# Altium schematic sheet capstone_v1.1.SchDoc
size B; SheetNumber: 1; SheetTotal: 1
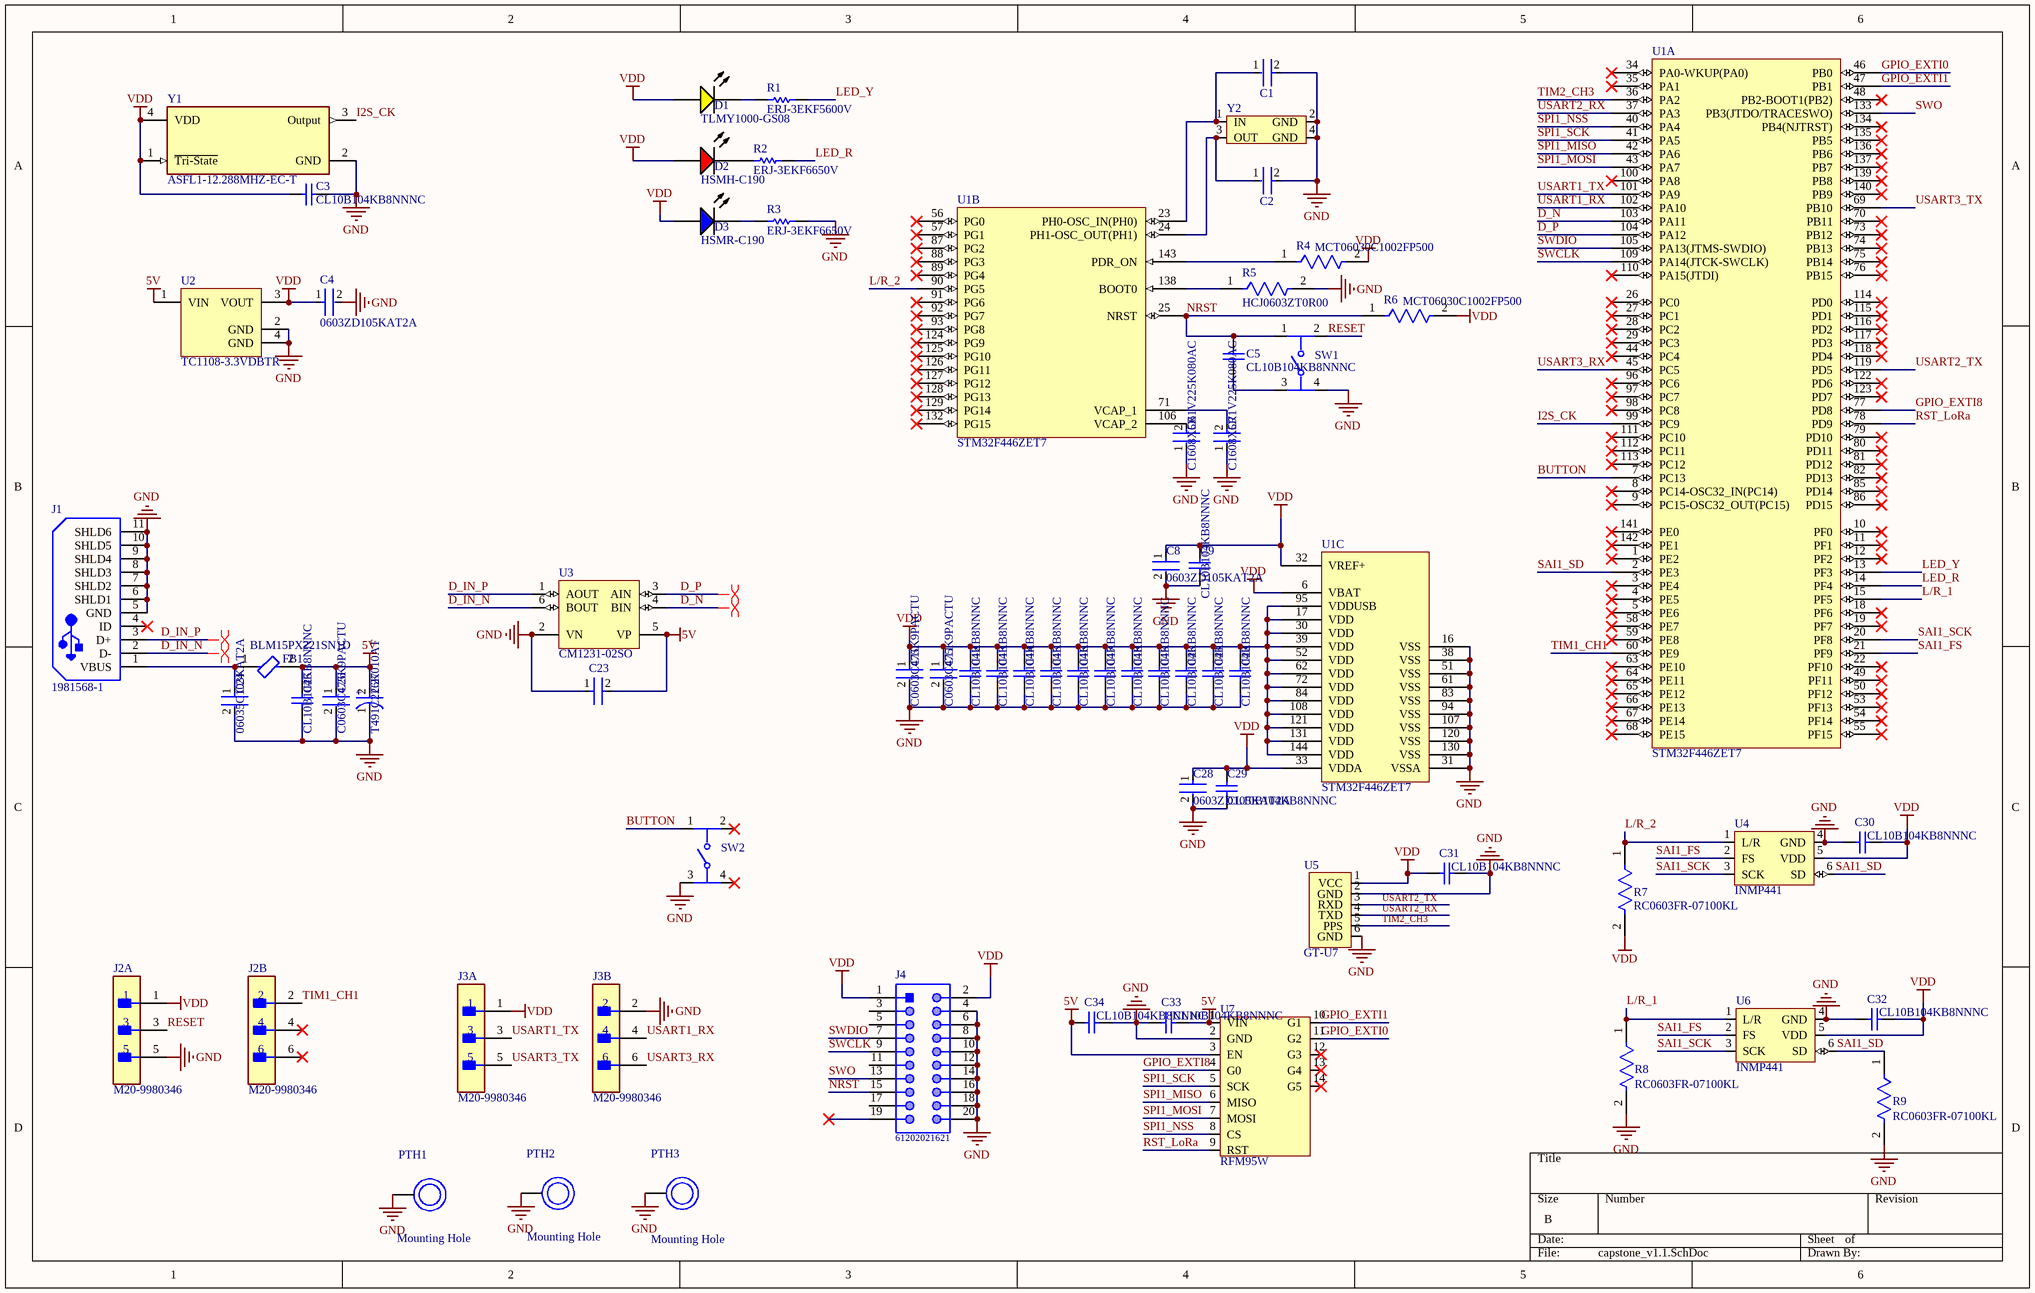
[diagram p0: capstone_v1.1.SchDoc]

## Parts
C1  C1608C0G1H150J080AA  [FP-C1608-080-0_1-MFG]  (value not drawn)
C2  C1608C0G1H150J080AA  [FP-C1608-080-0_1-MFG]  (value not drawn)
C3  CL10B104KB8NNNC  [SAMS-C0603-2_M]
C4  0603ZD105KAT2A  [FP-0603-L_1_6_0_15-W_0_81-IPC_A]
C5  CL10B104KB8NNNC  [SAMS-C0603-2_M]
C6  C1608X5R1V225K080AC  [FP-C1608-080-0_1-MFG]
C7  C1608X5R1V225K080AC  [FP-C1608-080-0_1-MFG]
C8  0603ZD105KAT2A  [FP-0603-L_1_6_0_15-W_0_81-IPC_A]
C9  CL10B104KB8NNNC  [SAMS-C0603-2_M]
C10  C0603C475K9PACTU  [FP-C0603-CG-MFG]
C11  C0603C475K9PACTU  [FP-C0603-CG-MFG]
C12  CL10B104KB8NNNC  [SAMS-C0603-2_M]
C13  CL10B104KB8NNNC  [SAMS-C0603-2_M]
C14  CL10B104KB8NNNC  [SAMS-C0603-2_M]
C15  CL10B104KB8NNNC  [SAMS-C0603-2_M]
C16  CL10B104KB8NNNC  [SAMS-C0603-2_M]
C17  CL10B104KB8NNNC  [SAMS-C0603-2_M]
C18  CL10B104KB8NNNC  [SAMS-C0603-2_M]
C19  CL10B104KB8NNNC  [SAMS-C0603-2_M]
C20  CL10B104KB8NNNC  [SAMS-C0603-2_M]
C21  CL10B104KB8NNNC  [SAMS-C0603-2_M]
C22  CL10B104KB8NNNC  [SAMS-C0603-2_M]
C23  GRM188R71E224KA88D  [FP-GRM188-0_1-e0_2_0_5-IPC_C]  (value not drawn)
C24  06035C103KAT2A  [FP-0603-L_1_6_0_15-W_0_81-MFG]
C25  CL10B104KB8NNNC  [SAMS-C0603-2_M]
C26  C0603C475K9PACTU  [FP-C0603-CG-MFG]
C27  T491C226K010AT  [FP-T491C226K010AT-MFG]
C28  0603ZD105KAT2A  [FP-0603-L_1_6_0_15-W_0_81-IPC_A]
C29  CL10B104KB8NNNC  [SAMS-C0603-2_M]
C30  CL10B104KB8NNNC  [SAMS-C0603-2_M]
C31  CL10B104KB8NNNC  [SAMS-C0603-2_M]
C32  CL10B104KB8NNNC  [SAMS-C0603-2_M]
C33  CL10B104KB8NNNC  [SAMS-C0603-2_M]
C34  CL10B104KB8NNNC  [SAMS-C0603-2_M]
D1  TLMY1000-GS08  [VISH-TLMY1000_V]
D2  HSMH-C190  [AVAG-HSMX-C190_V]
D3  HSMR-C190  [AVAG-HSMX-C190_V]
FB1  BLM15PX221SN1D  [FP-BLM15-0_05-IPC_A]
J1  1981568-1  [TECO-1981568-5_V]
J2  M20-9980346  [FP-M20-9980346-MFG]  (parts A,B of 2)
J3  M20-9980346  [FP-M20-9980346-MFG]  (parts A,B of 2)
J4  61202021621  [61202021621]
PTH1  Mounting Hole  [MB Stand off]
PTH2  Mounting Hole  [MB Stand off]
PTH3  Mounting Hole  [MB Stand off]
R1  ERJ-3EKF5600V  [RESC1608X55X30ML15T15]
R2  ERJ-3EKF6650V  [RESC1608X55X30ML15T15]
R3  ERJ-3EKF6650V  [RESC1608X55X30ML15T15]
R4  MCT06030C1002FP500  [FP-MCT0603-IPC_C]
R5  HCJ0603ZT0R00  [FP-HCJ0603-MFG]
R6  MCT06030C1002FP500  [FP-MCT0603-IPC_C]
R7  RC0603FR-07100KL  [FP-RC0603-0_55-MFG]
R8  RC0603FR-07100KL  [FP-RC0603-0_55-MFG]
R9  RC0603FR-07100KL  [FP-RC0603-0_55-MFG]
SW1  PTS645SM43SMTR92LFS  [FP-PTS645SM43SMTR92LFS-MFG]  (value not drawn)
SW2  PTS645SM43SMTR92LFS  [FP-PTS645SM43SMTR92LFS-MFG]  (value not drawn)
U1  STM32F446ZET7  [STM-LQFP144_M]  (parts A,B,C of 3)
U2  TC1108-3.3VDBTR  [SOT-223-DB3_L]
U3  CM1231-02SO  [ONSC-SOT23-6-527AJ_V]
U4  INMP441  [INMP441]
U5  GT-U7  [GT U7 GPS]
U6  INMP441  [INMP441]
U7  RFM95W  [RFM95W]
Y1  ASFL1-12.288MHZ-EC-T  [FP-ASFL1-MFG]
Y2  2151-RH100-8.000-10-1010-EXT-TRCT-ND  [2151-RH100-8.000-10-1010-EXT-TRCT-ND]  (value not drawn)

## Nets
5V: C23.2 C25.2 C26.1 C27.2(A) C33.1 C34.2 FB1.2 U2.1(VIN) U3.5(VP) U7.1(VIN) U7.3(EN)
GND: C1.2 C2.2 C3.1 C4.2 C6.1 C7.1 C8.2 C9.1 C10.2 C11.2 C12.1 C13.1 C14.1 C15.1 C16.1 C17.1 C18.1 C19.1 C20.1 C21.1 C22.1 C23.1 C24.2 C25.1 C26.2 C27.1(C) C28.2 C29.1 C30.2 C31.1 C32.2 C33.2 C34.1 J1.5(GND) J1.6(SHLD1) J1.7(SHLD2) J1.8(SHLD3) J1.9(SHLD4) J1.10(SHLD5) J1.11(SHLD6) J2.5 J3.2 J4.4 J4.6 J4.8 J4.10 J4.12 J4.14 J4.16 J4.18 J4.20 PTH1.1 PTH2.1 PTH3.1 R3.2 R5.2 R8.2 R9.2 SW1.4 SW2.3 U1.16(VSS) U1.31(VSSA) U1.38(VSS) U1.51(VSS) U1.61(VSS) U1.83(VSS) U1.94(VSS) U1.107(VSS) U1.120(VSS) U1.130(VSS) U2.2(GND) U2.4(GND) U3.2(VN) U4.4(GND) U5.2(GND) U5.6(GND) U6.4(GND) U7.2(GND) Y1.2(GND) Y2.2(GND) Y2.4(GND)
VDD: C3.2 C4.1 C8.1 C9.2 C10.1 C11.1 C12.2 C13.2 C14.2 C15.2 C16.2 C17.2 C18.2 C19.2 C20.2 C21.2 C22.2 C28.1 C29.2 C30.1 C31.2 C32.1 D1.1(A) D2.1(A) D3.1(A) J2.1 J3.1 J4.1 J4.2 R4.2 R6.2 R7.2 U1.6(VBAT) U1.17(VDD) U1.30(VDD) U1.32(VREF+) U1.33(VDDA) U1.39(VDD) U1.52(VDD) U1.62(VDD) U1.72(VDD) U1.84(VDD) U1.95(VDDUSB) U1.108(VDD) U1.121(VDD) U1.131(VDD) U1.144(VDD) U2.3(VOUT) U4.5(VDD) U5.1(VCC) U6.5(VDD) Y1.1(~{Tri-State}) Y1.4(VDD)
BUTTON: SW2.1 U1.7(PC13)
D_IN_N: J1.2(D-) U3.6(BOUT)
D_IN_P: J1.3(D+) U3.1(AOUT)
D_N: U1.103(PA11) U3.4(BIN)
D_P: U1.104(PA12) U3.3(AIN)
GPIO_EXTI0: U1.46(PB0) U7.11(G2)
GPIO_EXTI1: U1.47(PB1) U7.10(G1)
GPIO_EXTI8: U1.77(PD8) U7.4(G0)
I2S_CK: U1.99(PC9) Y1.3(Output)
L/R_1: R8.1 U1.15(PF5) U6.1(L/R)
L/R_2: R7.1 U1.90(PG5) U4.1(L/R)
LED_R: R2.2 U1.14(PF4)
LED_Y: R1.2 U1.13(PF3)
NRST: C5.2 J4.15 R6.1 SW1.1 U1.25(NRST)
RESET: J2.3 SW1.2
RST_LoRa: U1.78(PD9) U7.9(RST)
SAI1_FS: U1.21(PF9) U4.2(FS) U6.2(FS)
SAI1_SCK: U1.20(PF8) U4.3(SCK) U6.3(SCK)
SAI1_SD: R9.1 U1.2(PE3) U4.6(SD) U6.6(SD)
SPI1_MISO: U1.42(PA6) U7.6(MISO)
SPI1_MOSI: U1.43(PA7) U7.7(MOSI)
SPI1_NSS: U1.40(PA4) U7.8(CS)
SPI1_SCK: U1.41(PA5) U7.5(SCK)
SWCLK: J4.9 U1.109(PA14(JTCK-SWCLK))
SWDIO: J4.7 U1.105(PA13(JTMS-SWDIO))
SWO: J4.13 U1.133(PB3(JTDO/TRACESWO))
TIM1_CH1: J2.2 U1.60(PE9)
TIM2_CH3: U1.36(PA2) U5.5(PPS)
USART1_RX: J3.4 U1.102(PA10)
USART1_TX: J3.3 U1.101(PA9)
USART2_RX: U1.37(PA3) U5.4(TXD)
USART2_TX: U1.119(PD5) U5.3(RXD)
USART3_RX: J3.6 U1.45(PC5)
USART3_TX: J3.5 U1.69(PB10)
NetC1_1: C1.1 U1.23(PH0-OSC_IN(PH0)) Y2.1(IN)
NetC2_1: C2.1 U1.24(PH1-OSC_OUT(PH1)) Y2.3(OUT)
NetC5_1: C5.1 SW1.3
NetC6_2: C6.2 U1.106(VCAP_2)
NetC7_2: C7.2 U1.71(VCAP_1)
NetC24_1: C24.1 FB1.1 J1.1(VBUS)
NetD1_2: D1.2(K) R1.1
NetD2_2: D2.2(K) R2.1
NetD3_2: D3.2(K) R3.1
NetR4_1: R4.1 U1.143(PDR_ON)
NetR5_1: R5.1 U1.138(BOOT0)

Not connected (* = marked no-connect by the designer): J1 4(ID)*; J2 4* 6*; J4 3 5 11 17 19*; SW2 2* 4*; U1 1(PE2)* 3(PE4)* 4(PE5)* 5(PE6)* 8(PC14-OSC32_IN(PC14))* 9(PC15-OSC32_OUT(PC15))* 10(PF0)* 11(PF1)* 12(PF2)* 18(PF6)* 19(PF7)* 22(PF10)* 26(PC0)* 27(PC1)* 28(PC2)* 29(PC3)* 34(PA0-WKUP(PA0))* 35(PA1)* 44(PC4)* 48(PB2-BOOT1(PB2))* 49(PF11)* 50(PF12)* 53(PF13)* 54(PF14)* 55(PF15)* 56(PG0)* 57(PG1)* 58(PE7)* 59(PE8)* 63(PE10)* 64(PE11)* 65(PE12)* 66(PE13)* 67(PE14)* 68(PE15)* 70(PB11)* 73(PB12)* 74(PB13)* 75(PB14)* 76(PB15)* 79(PD10)* 80(PD11)* 81(PD12)* 82(PD13)* 85(PD14)* 86(PD15)* 87(PG2)* 88(PG3)* 89(PG4)* 91(PG6)* 92(PG7)* 93(PG8)* 96(PC6)* 97(PC7)* 98(PC8)* 100(PA8)* 110(PA15(JTDI))* 111(PC10)* 112(PC11)* 113(PC12)* 114(PD0)* 115(PD1)* 116(PD2)* 117(PD3)* 118(PD4)* 122(PD6)* 123(PD7)* 124(PG9)* 125(PG10)* 126(PG11)* 127(PG12)* 128(PG13)* 129(PG14)* 132(PG15)* 134(PB4(NJTRST))* 135(PB5)* 136(PB6)* 137(PB7)* 139(PB8)* 140(PB9)* 141(PE0)* 142(PE1)*; U7 12(G3)* 13(G4)* 14(G5)*

## Layout directives
differential pair: D_IN_N, D_IN_P, D_N, D_P

## Notes on the sheet
- (in symbol CMP-03017-000041-1) +

## Library data of the parts
C1 C2 = CMP-08246-005526-1: Multilayer Ceramic Capacitors 15pF ±5% 50V C0G SMD 0603; Temperature Coefficient: 30ppm/°C; Thickness: 0.037inch; Number of Pins: 2; Height: 0.8mm; Depth: 0.8mm; Capacitance: 15pF; Voltage: 50V; Construction: Flat; Series: C; Radiation Hardening: No; Width: 0.031inch; Packaging: Tape and Reel; Voltage Rating (DC): 50V; Termination: SMD/SMT; RoHS Compliant: Yes; Voltage Rating: 50V; Case Code (Imperial): 0603; Package Quantity: 1; Min Operating Temperature: -55°C; Lead Free: Lead Free; Case Code (Metric): 1608; Max Operating Temperature: 125°C; Tolerance: 5%; REACH SVHC: No SVHC; Dielectric: C0G; Length: 1.6mm; Mount: Surface Mount; Weight: 7.1E-05oz; Dielectric Material: Ceramic; Case/Package: 0603
C3 C5 C9 C12-C22 C25 C29-C34 = CMP-2000-05332-1: Multi-layer Ceramic Capacitor, -55 to 125 degC, 2-Pin SMD (0603), RoHS, Tape and Reel; Manufacturer: Samsung Electro-Mechanics; Capacitance: 0.1µF; Rated Voltage: 50V; Dielectric: X7R; Tolerance (%): ±10%; Case Size/Dimension: 0603; Datasheet URL: https://datasheet.ciiva.com/29198/456651-da-01-en-vs-kondensator-0605-29198839.pdf; Manufacturer URL: http://www.samsungsem.com/global/index.jsp; Datasheet Version: Nov-10
C4 C8 C28 = CMP-2006-04559-3: General Purpose Ceramic Capacitor, 0603, 1uF, 10%, X5R, 15%, 10V; Insulation Resistance: 100GR; Dissipation Factor: 5%; Packaging: Tape and Reel; RoHS Compliant: Yes; Height: 0.9mm; Tolerance: 10%; Length: 1.6mm; Depth: 0.81mm; Case/Package: 0603; Max Operating Temperature: 85°C; Series: -; Dielectric: X5R; Construction: Flat; Capacitance: 1uF; REACH SVHC: No SVHC; Voltage Rating: 10V; Number of Pins: 2; Radiation Hardening: No; Case Code (Imperial): 0603; Min Operating Temperature: -55°C; Termination: SMD/SMT; Contact Plating: Tin; Voltage: 10V; Thickness: 0.035inch; Lead Free: Lead Free; Mount: Surface Mount; Width: 0.81mm; Voltage Rating (DC): 10V; Package Quantity: 4000; Case Code (Metric): 1608
C6 C7 = CMP-08246-004960-1: Multilayer Ceramic Capacitors 2.2μF ±10% 35V X5R SMD 0603; Capacitance: 2.2uF; Dielectric Material: Ceramic; Length: 1.6mm; Height: 0.8mm; Package Quantity: 1; Width: 0.031inch; Radiation Hardening: No; Lead Free: Lead Free; Mount: Surface Mount; REACH SVHC: No SVHC; Construction: Flat; Voltage Rating (DC): 35V; Voltage Rating: 35V; Case/Package: 0603; Termination: SMD/SMT; Dielectric: X5R; Resistor Type: Ceramic; Thickness: 800um; Tolerance: 10%; Case Code (Metric): 1608; Case Code (Imperial): 0603; Weight: 7.1E-05oz; RoHS Compliant: Yes; Min Operating Temperature: -55°C; Series: C; Max Operating Temperature: 85°C; Depth: 0.8mm; Voltage: 35V; Packaging: Tape and Reel
C10 C11 C26 = CMP-2006-02256-2: CAP CER 4.7UF 6.3V X5R 0603; Manufacturer: Kemet; Temperature Coefficient: 15%; Tolerance: 10%; Material: Ceramic; Device Class L3: Ceramic Capacitors; RoHS: TRUE; Value: 4.7uF; Lead Free: Yes; ComponentLink2Description: Datasheet; Mouser Description: Multilayer Ceramic Capacitors MLCC - SMD/SMT 6.3volts 4.7uF X5R 10%; Package: C0603-CG; Digikey Description: CAP CER 4.7UF 6.3V X5R 0603; ComponentLink2URL: https://content.kemet.com/datasheets/KEM_C1006_X5R_SMD.pdf; Category: Cap; Temperature Range Low: -55°C; Capacitance: 4.7uF; Temperature: -55°C to +85°C; Octopart: https://octopart.com/c0603c475k9pactu-kemet-104242; Ipc Land Pattern Name: CAPC16080X80; Voltage Rating: 6.3V; Temperature Range High: +85°C; Height: 0.9mm; Temperature Characteristic: X5R; Device Class L1: Passive Components; Manufacturer Part Number: C0603C475K9PACTU; Automotive: No; Device Class L2: Capacitors
C23 = CMP-1035-02648-3: Chip Multilayer Ceramic Capacitors for General Purpose, 0603, 0.22uF, X7R, 15%, 10%, 25V; Voltage: 50V; Capacitance: 220nF; Number of Pins: 2; Length: 1.6mm; Material: Ceramic; Depth: 0.8mm; REACH SVHC: No SVHC; Voltage Rating (DC): 25V; Tolerance: 10%; Max Operating Temperature: 125°C; Lead Free: Lead Free; Package Quantity: 1; Voltage Rating: 25V; Width: 0.8mm; Case Code (Metric): 1608; Min Operating Temperature: -55°C; Case/Package: 0603; Mount: Surface Mount; Dielectric: X7R; Height: 0.8mm; Termination: SMD/SMT; Radiation Hardening: No; Case Code (Imperial): 0603; Thickness: 0.035inch; Packaging: Tape and Reel
C24 = CMP-2006-04374-2: General Purpose Ceramic Capacitor, 0603, 10nF, 10%, X7R, 15%, 50V; Insulation Resistance: 100GR; Dissipation Factor: 2.5%; Voltage: 50V; Number of Pins: 2; Min Operating Temperature: -55°C; Mount: Surface Mount; Capacitance: 10nF; Width: 0.032inch; Height: 0.9mm; Voltage Rating: 50V; Termination: SMD/SMT; Package Quantity: 1; Dielectric: X7R; Max Operating Temperature: 125°C; Contact Plating: Tin; Length: 1.6mm; Dielectric Material: Ceramic; REACH SVHC: No SVHC; Case Code (Imperial): 0603; Depth: 0.81mm; Thickness: 0.035inch; Packaging: Tape and Reel; Tolerance: 10%; Lead Free: Lead Free; Voltage Rating (DC): 50V; Radiation Hardening: No; Case/Package: 0603; Case Code (Metric): 1608
C27 = CMP-03017-000041-1: CAP TANT 22UF 10% 10V 2312; Polarity: Polar; Leakage Current: 2.2uA; Tolerance: 20%; Life (Hours): 2000Hour; Dissipation Factor: 6%; ESR (Equivalent Series Resistance): 1.8R; Dielectric Material: Tantalum; Packaging: Tape and Reel; Termination: SMD/SMT; Length: 6mm; Voltage Rating (DC): 10V; Series: T491; Case/Package: Molded; Lead Free: Lead Free; Mount: Surface Mount; RoHS Compliant: Yes; Number of Pins: 2; Voltage Rating: 10V; Case Code (Imperial): 2312; Width: 3.2mm; Case Code (Metric): 6032; Voltage: 10V; Depth: 3.2mm; Features: General Purpose; Height - Seated (Max): 0.11inch; Capacitance: 22uF; Size: 2.5mm; Max Operating Temperature: 125°C; Construction: Flat; REACH SVHC: No SVHC; Package Quantity: 1; Min Operating Temperature: -55°C; Radiation Hardening: No; Height: 2.5mm
D1 = CMP-2000-07255-1: Low Current LED, 40 mW, -40 to 100 degC, 2-Pin SMD, RoHS, Tape and Reel; Manufacturer: Vishay; Wavelength Typ: 595nm; Forward Current If: 2mA; Viewing Angle: 80°; Bulb Size: 1.6mmx0.8mm; Forward Voltage: 1.8V; Luminous Intensity: 7.5mcd; SVHC: ToBeAdvised; Automotive Qualification Standard: AEC-Q100; LED Colour: Yellow; Lens Shape: Rectangular; LED Mounting: SMD; Mounting Technology: SurfaceMount; Packaging: CutTape; MSL: MSL2-1year; Datasheet URL: http://www.vishay.com/docs/83172/tlmo1000.pdf; Package Reference: TLMY1000; Manufacturer URL: http://www.vishay.com/; Package Description: 2-Pin Surface Mount Device, Body 1.6 x 0.8 mm; Datasheet Version: Rev. 2.0, 09/2013; Product Range: -
D2 = CMP-1744-00004-1: LED Uni-Color Red, 65 mW, 20 mA, -40 to 85 degC, 2-Pin SMD, RoHS, Tape and Reel; Connector Type: USB; Gender: Male; Current Rating: 1 A; Length: 7.5 mm; Lead Pitch: 0.65 mm; PackageReference: HSMX-C190; Package Quantity: 2000; Max Operating Temperature: 85 degC; PackageDescription: 2-Pin Surface Mount Device, Body 1.6 x 0.8 mm, Height 0.9 mm; ComponentLink3Description: Package Specification; Mount: Surface Mount; Min Operating Temperature: -30 degC; ComponentLink3URL: http://www.fairchildsemi.com/dwg/MA/MA03D.pdf; ComponentLink1Description: Manufacturer URL; Contact Material: Copper; Pins: 5; Width: 5.6 mm; ComponentLink2Description: Datasheet; RoHSCompliant: true; DatasheetVersion: Mar-12; Height: 2.8 mm; Packaging: Tape and Reel; Contact Plating: Gold; ComponentLink1URL: http://www.avagotech.com/; REACH SVHC: No SVHC; ComponentLink2URL: http://docs.avagotech.com/docs/AV02-0551EN
D3 = CMP-1744-00007-1: LED Uni-Color Blue, 78 mW, 20 mA, -40 to 85 degC, 2-Pin SMD, RoHS, Tape and Reel; Rds On Max: 10 Ohm; Nominal Vgs: -1.7 V; Max Power Dissipation: 360 mW; Elements: 1; Case\Package: TO-236-3; Input Capacitance: 73 pF; Typical Rise Time: 6.3 ns; Nominal Dual Supply Voltage: -50 V; Packaging: Tape and Reel; Height: 0.93 mm; Mount: Surface Mount; RoHSCompliant: true; DatasheetVersion: Apr-10; REACH SVHC: No SVHC; ComponentLink1URL: http://www.avagotech.com/; Radiation Hardening: No; ComponentLink3Description: Package Specification; ComponentLink3URL: http://www.fairchildsemi.com/dwg/MA/MA03D.pdf; ComponentLink2Description: Datasheet; PackageDescription: 2-Pin Surface Mount Device, Body 1.6 x 0.8 mm, Height 0.9 mm; Package Quantity: 3000; PackageReference: HSMX-C190; ComponentLink1Description: Manufacturer URL; Pins: 3; Length: 2.92 mm; ComponentLink2URL: http://docs.avagotech.com/docs/AV02-0977EN; Min Operating Temperature: -55 degC; Width: 1.3 mm; Max Operating Temperature: 150 degC
FB1 = CMP-0686-00269-4: Chip Ferrite Bead, 0402, 220Ω @ 100MHz, 0.1Ω, 25%, 1.4A; DC Resistance (DCR): 100mR; Material: Steel; Number of Circuits: 1; Impedance: 220R; Lead Free: Lead Free; Packaging: Tape and Reel; Test Frequency: 100MHz; Current Rating: 1.4A; Length: 1mm; Package Quantity: 1; Termination: SMD/SMT; RoHS Compliant: Yes; Max Current Rating: 1.4A; Case/Package: 0402; Number of Pins: 2; Max Operating Temperature: 125°C; Series: BLM15PX; Width: 0.5mm; Case Code (Metric): 1005; Height: 0.5mm; Case Code (Imperial): 0402; Max DC Current: 1.4A; Tolerance: 25%; Number of Lines: 1; Min Operating Temperature: -55°C
J1 = CMP-2000-05408-1: Micro USB Receptacle Standard Type B Assy, 5-Pin SMD, RoHS, Tape and Reel; Manufacturer: TE Connectivity; Body Orientation: RightAngle; Number of Ports: 1Port; Number of Contacts: 5POS; Gender: RCP; Voltage Rating Max: 30VAC; Product Depth (mm): 5.6mm; Pitch (mm): 0.65mm; Current Rating (Max): 1/ContactA; Product Length (mm): 8mm; Product Height (mm): 3mm; Operating Temperature Max Deg. C: 85C; Datasheet URL: http://www.mouser.com/ds/2/418/NG_CD_1981568_E2-621296.pdf; Termination Method: Solder; Number of Terminals: 5; Operating Temp Range: -55Cto85C; Mounting Style: SurfaceMount; Manufacturer URL: http://www.te.com/; Contact Material: CopperAlloy; Packaging: TapeandReel; Datasheet Version: Rev. E2, 08/2015; Operating Temperature Min Deg. C: -55C; Housing Material: Thermoplastic; Type: MicroUSB; Contact Plating: GoldOverNickel
J2 J3 = CMP-2000-06636-2: CONN HEADER VERT 6POS 2.54MM; Manufacturer: Harwin; Current Rating: 3A; Number Of Contacts: 6; Conn Gender: Male; Conn Orientation: Vertical; Device Class L1: Connectors; ComponentLink2Description: Datasheet; Height: 8.99mm; Temperature Range High: +105°C; Contact Material: Tin,Nickel; RoHS: TRUE; Temperature Range Low: -40°C; ComponentLink2URL: https://cdn.harwin.com/pdfs/M20-998.pdf; Digikey Description: CONN HEADER VERT 6POS 2.54MM; Pitch: 2.54mm; Package: M20-9980346; Device Class L2: Headers and Wire Housings; Manufacturer Part Number: M20-9980346; Number Of Rows: 2; Category: Conn; Lead Free: Yes; Mouser Description: 2.54mm (0.1") Pitch DIL Vertical PC Tail Pin Header, 6.1mm mating pin height, tin, 3+3 contacts; Temperature: -40°C to +105°C; Device Class L3: unset; Octopart: https://octopart.com/m20-9980346-harwin-5436545; Automotive: No
J4 = CMP-1502-00010-1: Male Box Header WR-BHD, THT, Vertical, pitch 2.54 mm, 20 pins; Manufacturer: Wurth Elektronik; Contact Resistance: 20mOhm; Withstanding Voltage: 500VAC; Pitch: 2.54mm; Pin Number: 20; Working Voltage: 250VAC; Orientation: Vertical; Package Reference: 61202021621; Publisher: WurthElektronik; Datasheet URL: https://katalog.we-online.de/em/datasheet/6120xx21621.pdf; Operating Temperature: -40to125degC; Packaging: Tray; Part Number: 61202021621; Mounting Technology: THT; Gender: Male; Manufacturer URL: http://www.we-online.de; Published Date: August2018
PTH1-PTH3 = Mounting Hole: MB Standoffs
R1 = CMP-2000-00564-2: Chip Resistor, 560 Ohm, +/- 1%, 0.1 W, -55 to 155 degC, 0603 (1608 Metric), RoHS, Tape and Reel; Output Current: 2 A; Max Supply Voltage: 5 V; Min Supply Voltage: 3 V; Output Voltage: 35 V; Case\Package: QFN; Outputs: 1; PackageDescription: 2-Pin Surface Mount Device, Body 1.6 x 0.85 mm; ComponentLink1Description: Manufacturer URL; ComponentLink1URL: http://www.panasonic.com/; ComponentLink2Description: Datasheet; Package Quantity: 1500; DatasheetVersion: Apr-15; Min Operating Temperature: -20 degC; PackageReference: 0603; RoHSCompliant: true; Packaging: Tape and Reel; ComponentLink2URL: http://industrial.panasonic.com/cdbs/www-data/pdf/RDA0000/AOA0000C86.pdf; Radiation Hardening: No; REACH SVHC: No SVHC; Mount: Surface Mount; Max Operating Temperature: 85 degC; Pins: 28
R2 R3 = CMP-2000-00608-1: Manufacturer: Panasonic; Part Number: ERJ-3EKF6650V
R4 R6 = CMP-02407-000418-1: RES SMD 100 OHM 1% 1/8W 0603; Voltage Rating: 75V; Power Rating: 100mW; Temperature Coefficient: 50ppm/°C; Max Power Dissipation: 125mW; Resistance: 10kR; Case/Package: 0603; Military Standard: Not; Min Operating Temperature: -55°C; Width: 0.8mm; Package Quantity: 1; Max Operating Temperature: 125°C; Tolerance: 1%; Depth: 0.85mm; Radiation Hardening: No; Mount: Surface Mount; Composition: Thin Film; Contact Plating: Tin; Lead Free: Lead Free; Case Code (Imperial): 0603; Number of Terminations: 2; Voltage Rating (DC): 75V; Length: 1.55mm; Packaging: Tape and Reel; Height: 0.022inch; Case Code (Metric): 1608
R5 = CMP-26527-000122-1: RES 0 OHM JUMPER 1/4W 0603; Resistance: 0mR; Termination: Wraparound; Mount: Surface Mount; Min Operating Temperature: -55°C; Number of Terminations: 2; Packaging: Tape and Reel; Case Code (Imperial): 0603; Height: 0.021inch; RoHS Compliant: Yes; Width: 0.031inch; Package Quantity: 5000; Max Operating Temperature: 155°C; Radiation Hardening: No; Case/Package: 0603; Length: 0.061inch; Case Code (Metric): 1608
R7-R9 = CMP-2100-03662-2: RES SMD 100K OHM 1% 1/10W 0603; Voltage Rating (DC): 50V; Resistance: 100kR; Max Power Dissipation: 100mW; Temperature Coefficient: 100ppm/°C; Working Voltage: 75V; Length: 1.6mm; Lead Free: Lead Free; Number of Terminations: 2; Packaging: Tape and Reel; Voltage Rating: 50V; Termination: SMD/SMT; Width: 0.8mm; Resistor Type: Thick Film; Resistance Tolerance: 1%; Features: Moisture Resistant; Height: 0.45mm; Construction: Rectangular; Case/Package: 0603; Military Standard: Not; Case Code (Imperial): 0603; Series: RC; Technology: THICK FILM; Depth: 0.8mm; RoHS Compliant: Yes; REACH SVHC: No SVHC; Min Operating Temperature: -55°C; Case Code (Metric): 1608; Max Operating Temperature: 155°C; Power Rating: 100mW; Number of Pins: 2; Tolerance: 1%
SW1 SW2 = CMP-2000-05160-2: SWITCH TACTILE SPST-NO 0.05A 12V; Contact Resistance: 100mR; Throw Configuration: SPST; Illumination Type: Non-Illuminated; Mechanical Life: 100000Cycles; Current Rating: 50mA; Switch Function: Off-Mom; Actuator Length: 0.85mm; Actuator Material: Nylon; Actuator Type: Standard; Operating Force: 160gf; Min Operating Temperature: -20°C; REACH SVHC: No SVHC; Termination: Gull Wing; Case/Package: SMD/SMT; Packaging: Tape and Reel; Mount: Surface Mount; Voltage Rating (DC): 12V; Orientation: Straight; Lead Free: Lead Free; Contact Material: Silver; Color: Black; Max Current Rating: 50mA; Contact Plating: Silver; Depth: 9mm; Package Quantity: 1; Max Voltage Rating (DC): 12V; Length: 6mm; Max Operating Temperature: 60°C
U1 = CMP-0243-00227-1: ARM Cortex-M4 32-bit MCU+FPU, 512 KB Flash, 128 KB Internal RAM, 114 I/Os, 144-Pin LQFP, -40 to 105 degC, Tray; Operating Frequency(F) (Processor speed) (MHz): 180; FLASH Size (Prog) (kB): 512; D/A Converter: 2; Internal RAM Size (kB): 128; I/Os (High Current): 114; Supply Voltage(Vcc) min (V): 1.7; Package Reference: 144-Pin Low Profile Quad Flat Package, Body 20 x 20 mm, Pitch 0.5 mm; Package Description: LQFP144; DatasheetVersion: Rev. 6; ComponentLink2Description: Datasheet; Mounting Technology: Surface Mount; Packing: Tray; ComponentLink2URL: http://www.st.com/st-web-ui/static/active/en/resource/technical/document/datasheet/DM00141306.pdf; Core: ARM Cortex-M4; ComponentLink1URL: http://www.st.com/; ComponentLink1Description: Manufacturer URL
U2 = CMP-0136-00450-1: 300mA CMOS LDO, 3-Pin SOT-223, Extended Temperature, Tape and Reel; PackageReference: SOT-223-DB3; PackageDescription: 3-Lead Plastic Small Outline Transistor (DB) [SOT-223]; PackageVersion: revBB, Aug-2009; DatasheetVersion: revB, 2002
U3 = CMP-1063-00178-1: 2-Channel Low-Capacitance ESD Protection Array, 6-Pin SOT-23, Pb-Free, Tape and Reel; Manufacturer: On Semiconductor; Direction: Bidirectional; PPK Max (W): 0.225; Number of Lines: 2; Mounting Technology: Surface Mount; PartNumber: CM1231-02SO; PackageDescription: 6-Pin Small Outline Transistor, Body 2.85 x 1.55 mm, Pitch 0.95 mm; ComponentLink1Description: Manufacturer URL; ComponentLink2URL: http://www.onsemi.com/pub_link/Collateral/CM1231%20DATA%20SHEET.PDF; ComponentLink1URL: http://www.onsemi.com/; RoHS: Pb-Free; ComponentLink2Description: Datasheet; DatasheetVersion: Rev. 3; PackageReference: SOT23-6-527AJ; Packing: Tape and Reel; ComponentLink3URL: http://www.onsemi.com/pub_link/Collateral/527AJ.PDF; ComponentLink3Description: Package Specification; PackageVersion: Rev. B, 02/2012
U4 U6 = INM4P441: Microphone Module
U5 = GT-U7: GPS Module
U7 = RFM95W: LoRa Module
Y1 = CMP-27762-010926-1: XTAL Oscillator 12.288MHz ±50ppm HCMOS, TTL 3.3V 4-SMD 5mm x 3.2mm; Min Supply Voltage: 2.97V; Max Supply Current: 15mA; Max Supply Voltage: 3.63V; Load Capacitance: 15pF; Frequency Stability: 50ppm; Series: ASFL1; Number of Pins: 4; Operating Supply Voltage: 3.3V; Frequency: 12.288MHz; Depth: 3.2mm; Width: 0.126inch; Packaging: Tape and Reel; Mount: Surface Mount; Lead Free: Lead Free; Height: 0.051inch; Case/Package: SMD/SMT; Min Operating Temperature: -20°C; Max Operating Temperature: 70°C; Termination: SMD/SMT; Radiation Hardening: No; Length: 5mm; Operating Frequency: 12.288 MHz
Y2 = 2151-RH100-8.000-10-1010-EXT-TRCT-ND: 8 MHz Oscillator